# EAGLE schematic ray (EAGLE 9.5.1)
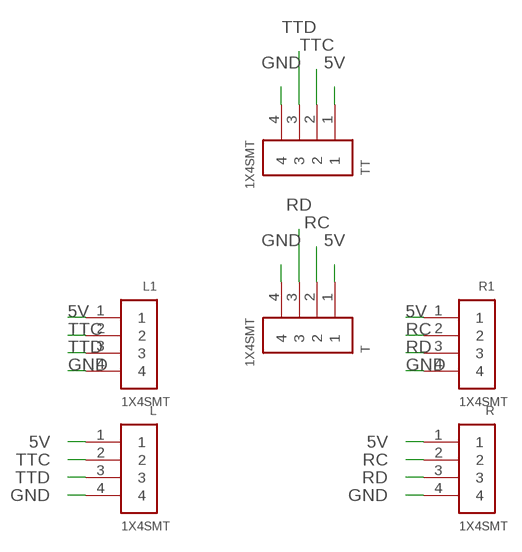
[diagram p0: schematic, sheet 1]

## Parts
L  1X4SMT  [1X4-SMT]
L1  1X4SMT  [1X4-SMT]
R  1X4SMT  [1X4-SMT]
R1  1X4SMT  [1X4-SMT]
T  1X4SMT  [1X4-SMT]
TT  1X4SMT  [1X4-SMT]

## Nets
5V: L1.1 L.1 R1.1 R.1 T.1 TT.1
GND: L1.4 L.4 R1.4 R.4 T.4 TT.4
RC: R1.2 R.2 T.2
RD: R1.3 R.3 T.3
TTC: L1.2 L.2 TT.2
TTD: L1.3 L.3 TT.3

## Library data of the parts
L L1 R R1 T TT = adafruit:1X4: 4-pin connector